# EAGLE schematic smart_plug_new v3 (EAGLE 9.7.0)
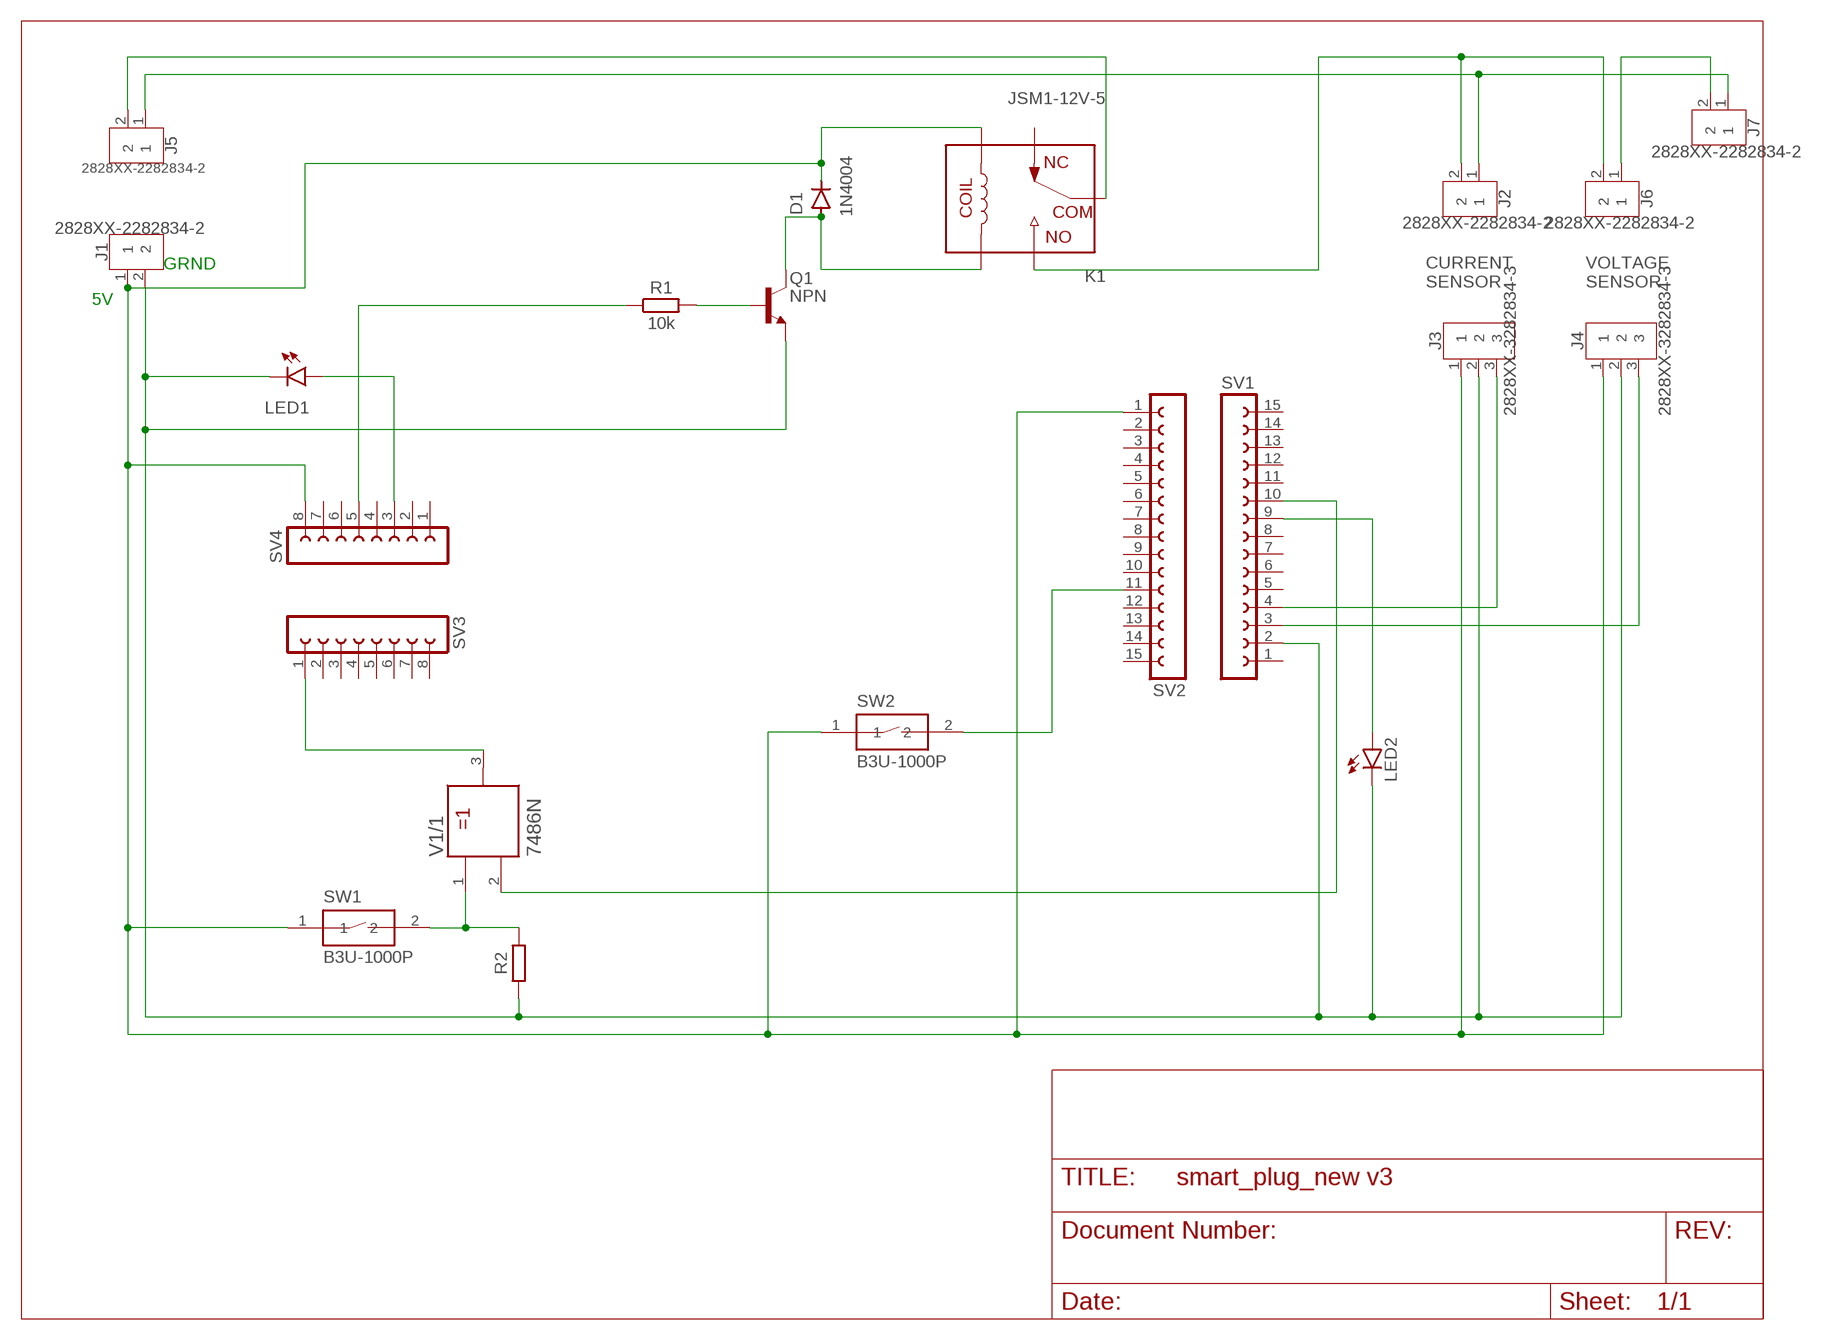
[diagram p0: schematic, sheet 1]

## Parts
D1  1N4004  [DO-41]
J1  2828XX-2282834-2  [TERMBLK_254-2N]
J2  2828XX-2282834-2  [TERMBLK_254-2N]
J3  2828XX-3282834-3  [TERMBLK_254-3N]
J4  2828XX-3282834-3  [TERMBLK_254-3N]
J5  2828XX-2282834-2  [TERMBLK_254-2N]
J6  2828XX-2282834-2  [TERMBLK_254-2N]
J7  2828XX-2282834-2  [TERMBLK_254-2N]
K1  JSM1-12V-5  [JSM1-12V-5]
LED1  LED5MM  [LED5MM]
LED2  LED5MM  [LED5MM]
Q1  NPN  NPN__TO92  [TO92]
R1  10k  R_AXIAL-11.7MM-PITCH  [RESAD1176W63L850D250B]
R2  R_AXIAL-11.7MM-PITCH  [RESAD1176W63L850D250B]
SV1  FE15-1  [FE15]
SV2  FE15-1  [FE15]
SV3  FE08W  [FE08W]
SV4  FE08W  [FE08W]
SW1  B3U-1000P  [B3U-1000P]
SW2  B3U-1000P  [B3U-1000P]
V1  7486N  [DIL14]

## Nets
N$1: D1.C J1.1 J3.1 J4.1 K1.5 SV2.1 SV4.8 SW1.1 SW2.1
N$2: SV3.1 V1.3(/1:Y)
N$3: R2.2 SW1.2 V1.1(/1:A)
N$4: LED1.A SV4.3
N$5: J1.2 J3.2 J4.2 LED1.K(C) LED2.K(C) Q1.3(E) R2.1 SV1.2
N$6: R1.1 SV4.5
N$7: Q1.2(B) R1.2
N$8: D1.A K1.2 Q1.1(C)
N$9: J5.2 K1.1
N$10: J2.2 J6.2 K1.3
N$11: SV1.10 V1.2(/1:B)
N$12: J6.1 J7.2
N$13: J2.1 J5.1 J7.1
N$14: SV2.11 SW2.2
N$15: J3.3 SV1.4
N$16: J4.3 SV1.3
N$17: LED2.A SV1.9
Unconnected: K1.4 SV1.1 SV1.5 SV1.6 SV1.7 SV1.8 SV1.11 SV1.12 SV1.13 SV1.14 SV1.15 SV2.2 SV2.3 SV2.4 SV2.5 SV2.6 SV2.7 SV2.8 SV2.9 SV2.10 SV2.12 SV2.13 SV2.14 SV2.15 SV3.2 SV3.3 SV3.4 SV3.5 SV3.6 SV3.7 SV3.8 SV4.1 SV4.2 SV4.4 SV4.6 SV4.7 V1.4(/2:A) V1.5(/2:B) V1.6(/2:Y) V1.8(/3:Y) V1.9(/3:A) V1.10(/3:B) V1.11(/4:Y) V1.12(/4:A) V1.13(/4:B)

## Notes on the sheet
- GRND
- CURRENT
  SENSOR
- VOLTAGE
  SENSOR
- 5V

## Power pins joined to a net without a drawn wire
+UB: V1.14(/+UB:+UB)
-UB: V1.7(/-UB:-UB)

## Library data of the parts
D1 = Diodes:1N4004: DIODE GEN PURP 400V 1A DO41 Manufacturer's datasheet <https://www.mccsemi.com/pdf/Products/1N4001-1N4007(DO-41).pdf>; CREATED_BY: PCBLayout.com; DIGIKEY_PART_NUMBER: 1N4004MSCT-ND; MANUFACTURER: Micro Commercial Co; MPN: 1N4004; PACKAGE: DO-41
J1 J2 J5-J7 = Connector:2828XX-2: 2 Position Wire to Board Terminal Block Horizontal with Board Datasheet <https://www.te.com.cn/commerce/DocumentDelivery/DDEController?Action=showdoc&DocId=Catalog+Section%7F1308389_EUROSTYLE_TERMINAL_BLOCKS%7F0607%7Fpdf%7FEnglish%7FENG_CS_1308389_EUROSTYLE_TERMINAL_BLOCKS_0607.pdf%7F2-282837-5>; CATEGORY: Fixed Terminal Blocks; DESCRIPTION: Fixed Terminal Blocks 2P SIDE ENTRY 2.54mm; MANUFACTURER: TE Connectivity AMP Connectors; MPN: 282834-2; OPERATING_TEMPERATURE: -40°C ~ 105°C; PART_STATUS: Active; PITCH: 0.100" (2.54mm); ROHS_COMPLIANCE: RoHS Compliant; SERIES: Buchanan; SUBCATEGORY: Terminal Blocks; TYPE: Through Hole; Screw - Rising Cage Clamp; Side wire entry, Horizontal with Board
J3 J4 = Connector:2828XX-3: 3 Position Wire to Board Terminal Block Horizontal with Board Datasheet <https://www.te.com.cn/commerce/DocumentDelivery/DDEController?Action=showdoc&DocId=Catalog+Section%7F1308389_EUROSTYLE_TERMINAL_BLOCKS%7F0607%7Fpdf%7FEnglish%7FENG_CS_1308389_EUROSTYLE_TERMINAL_BLOCKS_0607.pdf%7F2-282837-5>; CATEGORY: Fixed Terminal Blocks; DESCRIPTION: Fixed Terminal Blocks 3P TERMINAL BLOCK; MANUFACTURER: TE Connectivity AMP Connectors; MPN: 282834-3; OPERATING_TEMPERATURE: -40°C ~ 105°C; PART_STATUS: Active; PITCH: 0.100" (2.54mm); ROHS_COMPLIANCE: RoHS Compliant; SERIES: Buchanan; SUBCATEGORY: Terminal Blocks; TYPE: Through Hole; Screw - Rising Cage Clamp; Side wire entry, Horizontal with Board
K1 = Relay:JSM1-12V-5: RELAY AUTOMOTIVE SPDT 15A 12V Manufacturer's datasheet <https://media.digikey.com/pdf/Data%20Sheets/Panasonic%20Electric%20Works%20PDFs/JS-M_Series_Rev_Dec_2011.pdf>; CREATED_BY: PCBLayout.com; DIGIKEY_PARTNO: 255-1240-ND; MANUFACTURER: Panasonic Electric Works; MPN: JSM1-12V-5
LED1 LED2 = led:LED: LED OSRAM: - CHIPLED LG R971, LG N971, LY N971, LG Q971, LY Q971, LO R971, LY R971 LH N974, LH R974 LS Q976, LO Q976, LY Q976 LO Q996 - Hyper CHIPLED LW Q18S LB Q993, LB Q99A, LB R99A - SideLED LS A670, LO A670, LY A670, LG A670, LP A670 LB A673, LV A673, LT A673, LW A673 LH A674 LY A675 LS A676, LA A676, LO A676, LY A676, LW A676 LS A679, LY A679, LG A679 - Hyper Micro SIDELED® LS Y876, LA Y876, LO Y876, LY Y876 LT Y87S - SmartLED LW L88C, LW L88S LB L89C, LB L89S, LG L890 LS L89K, LO L89K, LY L89K LS L896, LA L896, LO L896, LY L896 - TOPLED LS T670, LO T670, LY T670, LG T670, LP T670 LSG T670, LSP T670, LSY T670, LOP T670, LYG T670 LG T671, LOG T671, LSG T671 LB T673, LV T673, LT T673, LW T673 LH T674 LS T676, LA T676, LO T676, LY T676, LB T676, LH T676, LSB T676, LW T676 LB T67C, LV T67C, LT T67C, LS T67K, LO T67K, LY T67K, LW E67C LS E67B, LA E67B, LO E67B, LY E67B, LB E67C, LV E67C, LT E67C LW T67C LS T679, LY T679, LG T679 LS T770, LO T770, LY T770, LG T770, LP T770 LB T773, LV T773, LT T773, LW T773 LH T774 LS E675, LA E675, LY E675, LS T675 LS T776, LA T776, LO T776, LY T776, LB T776 LHGB T686 LT T68C, LB T68C - Hyper Mini TOPLED® LB M676 - Mini TOPLED Santana® LG M470 LS M47K, LO M47K, LY M47K Source: http://www.osram.convergy.de LUXEON: - LUMILED® LXK2-PW12-R00, LXK2-PW12-S00, LXK2-PW14-U00, LXK2-PW14-V00 LXK2-PM12-R00, LXK2-PM12-S00, LXK2-PM14-U00 LXK2-PE12-Q00, LXK2-PE12-R00, LXK2-PE12-S00, LXK2-PE14-T00, LXK2-PE14-U00 LXK2-PB12-K00, LXK2-PB12-L00, LXK2-PB12-M00, LXK2-PB14-N00, LXK2-PB14-P00, LXK2-PB14-Q00 LXK2-PR12-L00, LXK2-PR12-M00, LXK2-PR14-Q00, LXK2-PR14-R00 LXK2-PD12-Q00, LXK2-PD12-R00, LXK2-PD12-S00 LXK2-PH12-R00, LXK2-PH12-S00 LXK2-PL12-P00, LXK2-PL12-Q00, LXK2-PL12-R00 Source: www.luxeon.com KINGBRIGHT: KA-3528ASYC Source: www.kingbright.com
Q1 = Tinkercad:NPN: NPN - Generic; CATEGORY: Transistor; SUB-CATEGORY: BJT; TYPE: NPN
R1 R2 = Resistor:R: Resistor Fixed - Generic; CATEGORY: Resistor; SUB-CATEGORY: Fixed
SV1 SV2 = con-lsta:FE15-1: FEMALE HEADER; OC_FARNELL: unknown; OC_NEWARK: unknown
SV3 SV4 = con-lsta:FE08W: FEMALE HEADER; OC_FARNELL: unknown; OC_NEWARK: unknown
SW1 SW2 = Switch:B3U-1000P: SWITCH TACTILE SPST-NO 0.05A 12V Manufacturer's datasheet <https://omronfs.omron.com/en_US/ecb/products/pdf/en-b3u.pdf>; CREATED_BY: PCBLayout.com; DIGI_KEY_PART_NUMBER: SW1020CT-ND; MANUFACTURER: Omron Electronics Inc-EMC Div; MPN: B3U-1000P; PACKAGE: SPST-NO
V1 = 74ttl-din:74*86: Quad 2-input EXCLUSIV-OR gate